# EAGLE schematic MMU8Ltqfp (EAGLE 6.6.0)

## Sheet 1 of 2
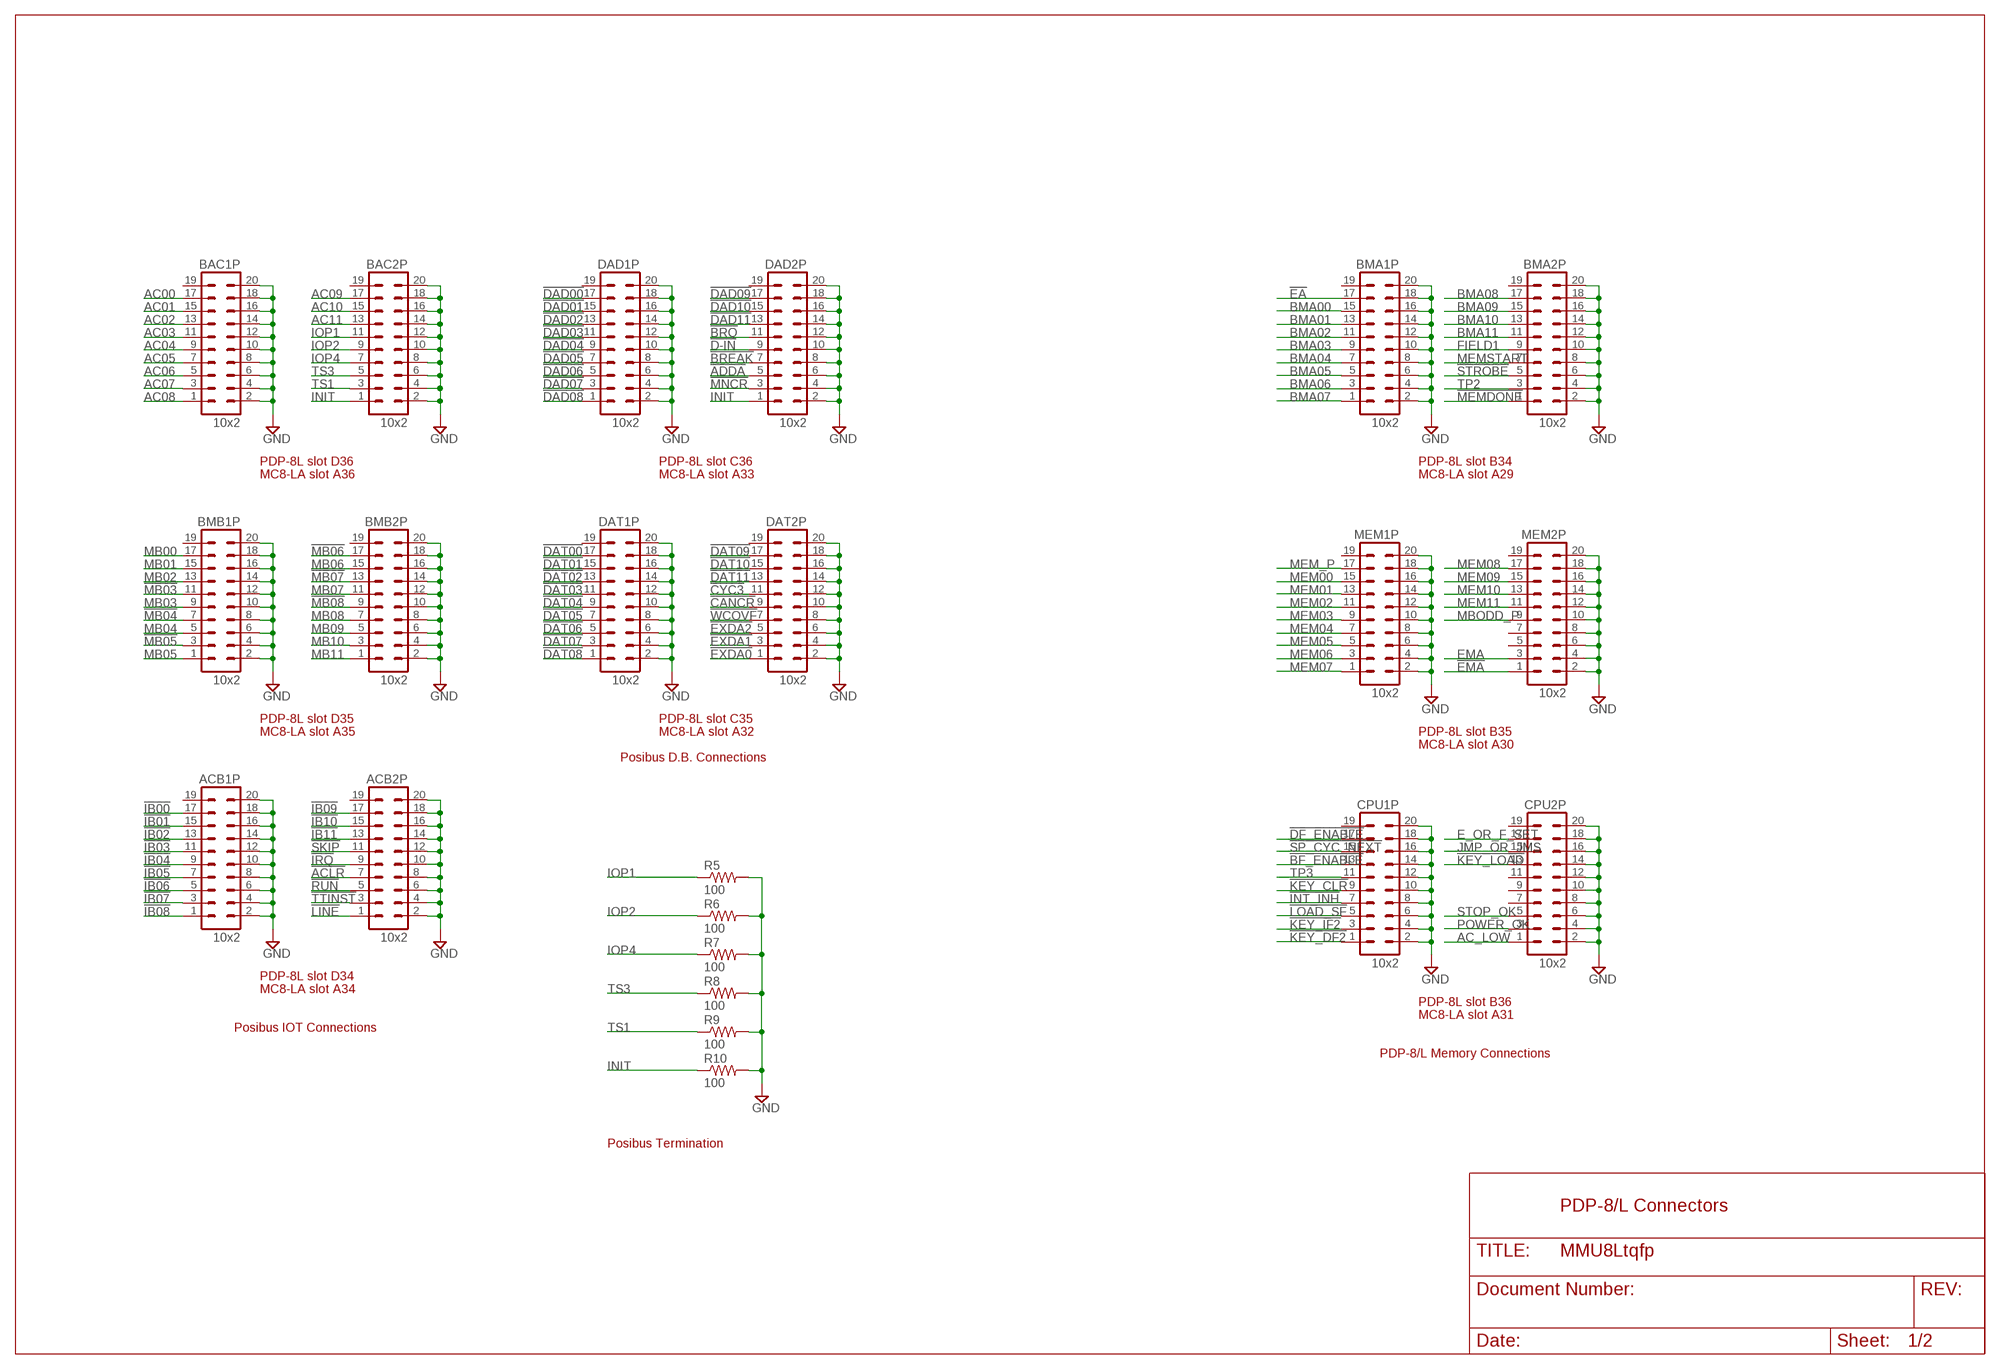
[diagram p0: schematic, sheet 1]

### Parts
ACB1P  10x2  MA10-2  [MA10-2]
ACB2P  10x2  MA10-2  [MA10-2]
BAC1P  10x2  MA10-2  [MA10-2]
BAC2P  10x2  MA10-2  [MA10-2]
BMA1P  10x2  MA10-2  [MA10-2]
BMA2P  10x2  MA10-2  [MA10-2]
BMB1P  10x2  MA10-2  [MA10-2]
BMB2P  10x2  MA10-2  [MA10-2]
CPU1P  10x2  MA10-2  [MA10-2]
CPU2P  10x2  MA10-2  [MA10-2]
DAD1P  10x2  MA10-2  [MA10-2]
DAD2P  10x2  MA10-2  [MA10-2]
DAT1P  10x2  MA10-2  [MA10-2]
DAT2P  10x2  MA10-2  [MA10-2]
MEM1P  10x2  MA10-2  [MA10-2]
MEM2P  10x2  MA10-2  [MA10-2]
R5  100  R-US_R1206  [R1206]
R6  100  R-US_R1206  [R1206]
R7  100  R-US_R1206  [R1206]
R8  100  R-US_R1206  [R1206]
R9  100  R-US_R1206  [R1206]
R10  100  R-US_R1206  [R1206]

### Nets
!ACLR: ACB2P.7 ; also sheet 2
!ADDA: DAD2P.5
!BF_ENABLE: CPU1P.13 ; also sheet 2
!BREAK: DAD2P.7
!BRQ: DAD2P.11
!CANCR: DAT2P.9
!CYC3: DAT2P.11
!D-IN: DAD2P.9
!DAD00: DAD1P.17
!DAD01: DAD1P.15
!DAD02: DAD1P.13
!DAD03: DAD1P.11
!DAD04: DAD1P.9
!DAD05: DAD1P.7
!DAD06: DAD1P.5
!DAD07: DAD1P.3
!DAD08: DAD1P.1
!DAD09: DAD2P.17
!DAD10: DAD2P.15
!DAD11: DAD2P.13
!DAT00: DAT1P.17
!DAT01: DAT1P.15
!DAT02: DAT1P.13
!DAT03: DAT1P.11
!DAT04: DAT1P.9
!DAT05: DAT1P.7
!DAT06: DAT1P.5
!DAT07: DAT1P.3
!DAT08: DAT1P.1
!DAT09: DAT2P.17
!DAT10: DAT2P.15
!DAT11: DAT2P.13
!DF_ENABLE: CPU1P.17 ; also sheet 2
!EA: BMA1P.17 ; also sheet 2
!EMA: MEM2P.1 ; also sheet 2
!EXDA0: DAT2P.1 ; also sheet 2
!EXDA1: DAT2P.3 ; also sheet 2
!EXDA2: DAT2P.5 ; also sheet 2
!IB00: ACB1P.17 ; also sheet 2
!IB01: ACB1P.15 ; also sheet 2
!IB02: ACB1P.13 ; also sheet 2
!IB03: ACB1P.11 ; also sheet 2
!IB04: ACB1P.9 ; also sheet 2
!IB05: ACB1P.7 ; also sheet 2
!IB06: ACB1P.5 ; also sheet 2
!IB07: ACB1P.3 ; also sheet 2
!IB08: ACB1P.1 ; also sheet 2
!IB09: ACB2P.17 ; also sheet 2
!IB10: ACB2P.15 ; also sheet 2
!IB11: ACB2P.13 ; also sheet 2
!INT_INH: CPU1P.7 ; also sheet 2
!IRQ: ACB2P.9 ; also sheet 2
!KEY_CLR: CPU1P.9 ; also sheet 2
!KEY_DF2: CPU1P.1 ; also sheet 2
!KEY_IF2: CPU1P.3 ; also sheet 2
!KEY_LOAD: CPU2P.13 ; also sheet 2
!LINE: ACB2P.1 ; also sheet 2
!LOAD_SF: CPU1P.5 ; also sheet 2
!MB03: BMB1P.11
!MB04: BMB1P.7
!MB05: BMB1P.3
!MB06: BMB2P.17
!MB07: BMB2P.13
!MB08: BMB2P.9
!MEMDONE: BMA2P.1 ; also sheet 2
!MNCR: DAD2P.3
!RUN: ACB2P.5 ; also sheet 2
!SKIP: ACB2P.11 ; also sheet 2
!SP_CYC_NEXT: CPU1P.15 ; also sheet 2
!STROBE: BMA2P.5 ; also sheet 2
!TTINST: ACB2P.3 ; also sheet 2
!WCOVF: DAT2P.7
AC00: BAC1P.17
AC01: BAC1P.15
AC02: BAC1P.13
AC03: BAC1P.11
AC04: BAC1P.9
AC05: BAC1P.7
AC06: BAC1P.5
AC07: BAC1P.3
AC08: BAC1P.1
AC09: BAC2P.17
AC10: BAC2P.15
AC11: BAC2P.13
AC_LOW: CPU2P.1 ; also sheet 2
BMA00: BMA1P.15 ; also sheet 2
BMA01: BMA1P.13 ; also sheet 2
BMA02: BMA1P.11 ; also sheet 2
BMA03: BMA1P.9 ; also sheet 2
BMA04: BMA1P.7 ; also sheet 2
BMA05: BMA1P.5 ; also sheet 2
BMA06: BMA1P.3 ; also sheet 2
BMA07: BMA1P.1 ; also sheet 2
BMA08: BMA2P.17 ; also sheet 2
BMA09: BMA2P.15 ; also sheet 2
BMA10: BMA2P.13 ; also sheet 2
BMA11: BMA2P.11 ; also sheet 2
E_OR_F_SET: CPU2P.17 ; also sheet 2
EMA: MEM2P.3 ; also sheet 2
FIELD1: BMA2P.9 ; also sheet 2
GND [supply]: ACB1P.2 ACB1P.4 ACB1P.6 ACB1P.8 ACB1P.10 ACB1P.12 ACB1P.14 ACB1P.16 ACB1P.18 ACB1P.20 ACB2P.2 ACB2P.4 ACB2P.6 ACB2P.8 ACB2P.10 ACB2P.12 ACB2P.14 ACB2P.16 ACB2P.18 ACB2P.20 BAC1P.2 BAC1P.4 BAC1P.6 BAC1P.8 BAC1P.10 BAC1P.12 BAC1P.14 BAC1P.16 BAC1P.18 BAC1P.20 BAC2P.2 BAC2P.4 BAC2P.6 BAC2P.8 BAC2P.10 BAC2P.12 BAC2P.14 BAC2P.16 BAC2P.18 BAC2P.20 BMA1P.2 BMA1P.4 BMA1P.6 BMA1P.8 BMA1P.10 BMA1P.12 BMA1P.14 BMA1P.16 BMA1P.18 BMA1P.20 BMA2P.2 BMA2P.4 BMA2P.6 BMA2P.8 BMA2P.10 BMA2P.12 BMA2P.14 BMA2P.16 BMA2P.18 BMA2P.20 BMB1P.2 BMB1P.4 BMB1P.6 BMB1P.8 BMB1P.10 BMB1P.12 BMB1P.14 BMB1P.16 BMB1P.18 BMB1P.20 BMB2P.2 BMB2P.4 BMB2P.6 BMB2P.8 BMB2P.10 BMB2P.12 BMB2P.14 BMB2P.16 BMB2P.18 BMB2P.20 CPU1P.2 CPU1P.4 CPU1P.6 CPU1P.8 CPU1P.10 CPU1P.12 CPU1P.14 CPU1P.16 CPU1P.18 CPU1P.20 CPU2P.2 CPU2P.4 CPU2P.6 CPU2P.8 CPU2P.10 CPU2P.12 CPU2P.14 CPU2P.16 CPU2P.18 CPU2P.20 DAD1P.2 DAD1P.4 DAD1P.6 DAD1P.8 DAD1P.10 DAD1P.12 DAD1P.14 DAD1P.16 DAD1P.18 DAD1P.20 DAD2P.2 DAD2P.4 DAD2P.6 DAD2P.8 DAD2P.10 DAD2P.12 DAD2P.14 DAD2P.16 DAD2P.18 DAD2P.20 DAT1P.2 DAT1P.4 DAT1P.6 DAT1P.8 DAT1P.10 DAT1P.12 DAT1P.14 DAT1P.16 DAT1P.18 DAT1P.20 DAT2P.2 DAT2P.4 DAT2P.6 DAT2P.8 DAT2P.10 DAT2P.12 DAT2P.14 DAT2P.16 DAT2P.18 DAT2P.20 MEM1P.2 MEM1P.4 MEM1P.6 MEM1P.8 MEM1P.10 MEM1P.12 MEM1P.14 MEM1P.16 MEM1P.18 MEM1P.20 MEM2P.2 MEM2P.4 MEM2P.6 MEM2P.8 MEM2P.10 MEM2P.12 MEM2P.14 MEM2P.16 MEM2P.18 MEM2P.20 R5.2 R6.2 R7.2 R8.2 R9.2 R10.2 ; also sheet 2
INIT: BAC2P.1 DAD2P.1 R10.1 ; also sheet 2
IOP1: BAC2P.11 R5.1 ; also sheet 2
IOP2: BAC2P.9 R6.1 ; also sheet 2
IOP4: BAC2P.7 R7.1 ; also sheet 2
JMP_OR_JMS: CPU2P.15 ; also sheet 2
MB00: BMB1P.17 ; also sheet 2
MB01: BMB1P.15 ; also sheet 2
MB02: BMB1P.13 ; also sheet 2
MB03: BMB1P.9 ; also sheet 2
MB04: BMB1P.5 ; also sheet 2
MB05: BMB1P.1 ; also sheet 2
MB06: BMB2P.15 ; also sheet 2
MB07: BMB2P.11 ; also sheet 2
MB08: BMB2P.7 ; also sheet 2
MB09: BMB2P.5 ; also sheet 2
MB10: BMB2P.3 ; also sheet 2
MB11: BMB2P.1 ; also sheet 2
MBODD_P: MEM2P.9 ; also sheet 2
MEM00: MEM1P.15 ; also sheet 2
MEM01: MEM1P.13 ; also sheet 2
MEM02: MEM1P.11 ; also sheet 2
MEM03: MEM1P.9 ; also sheet 2
MEM04: MEM1P.7 ; also sheet 2
MEM05: MEM1P.5 ; also sheet 2
MEM06: MEM1P.3 ; also sheet 2
MEM07: MEM1P.1 ; also sheet 2
MEM08: MEM2P.17 ; also sheet 2
MEM09: MEM2P.15 ; also sheet 2
MEM10: MEM2P.13 ; also sheet 2
MEM11: MEM2P.11 ; also sheet 2
MEM_P: MEM1P.17 ; also sheet 2
MEMSTART: BMA2P.7 ; also sheet 2
POWER_OK: CPU2P.3 ; also sheet 2
STOP_OK: CPU2P.5 ; also sheet 2
TP2: BMA2P.3 ; also sheet 2
TP3: CPU1P.11 ; also sheet 2
TS1: BAC2P.3 R9.1
TS3: BAC2P.5 R8.1
Unconnected: ACB1P.19 ACB2P.19 BAC1P.19 BAC2P.19 BMA1P.19 BMA2P.19 BMB1P.19 BMB2P.19 CPU1P.19 CPU2P.7 CPU2P.9 CPU2P.11 CPU2P.19 DAD1P.19 DAD2P.19 DAT1P.19 DAT2P.19 MEM1P.19 MEM2P.5 MEM2P.7 MEM2P.19

### Notes on the sheet
- PDP-8L slot D36 | PDP-8L slot C36 | PDP-8L slot B34
- MC8-LA slot A36 | MC8-LA slot A33 | MC8-LA slot A29
- PDP-8L slot D35 | PDP-8L slot C35
- MC8-LA slot A35 | MC8-LA slot A32 | PDP-8L slot B35
- MC8-LA slot A30
- Posibus D.B. Connections
- PDP-8L slot D34
- MC8-LA slot A34
- PDP-8L slot B36
- MC8-LA slot A31
- Posibus IOT Connections
- PDP-8/L Memory Connections
- Posibus Termination
- PDP-8/L Connectors

## Sheet 2 of 2
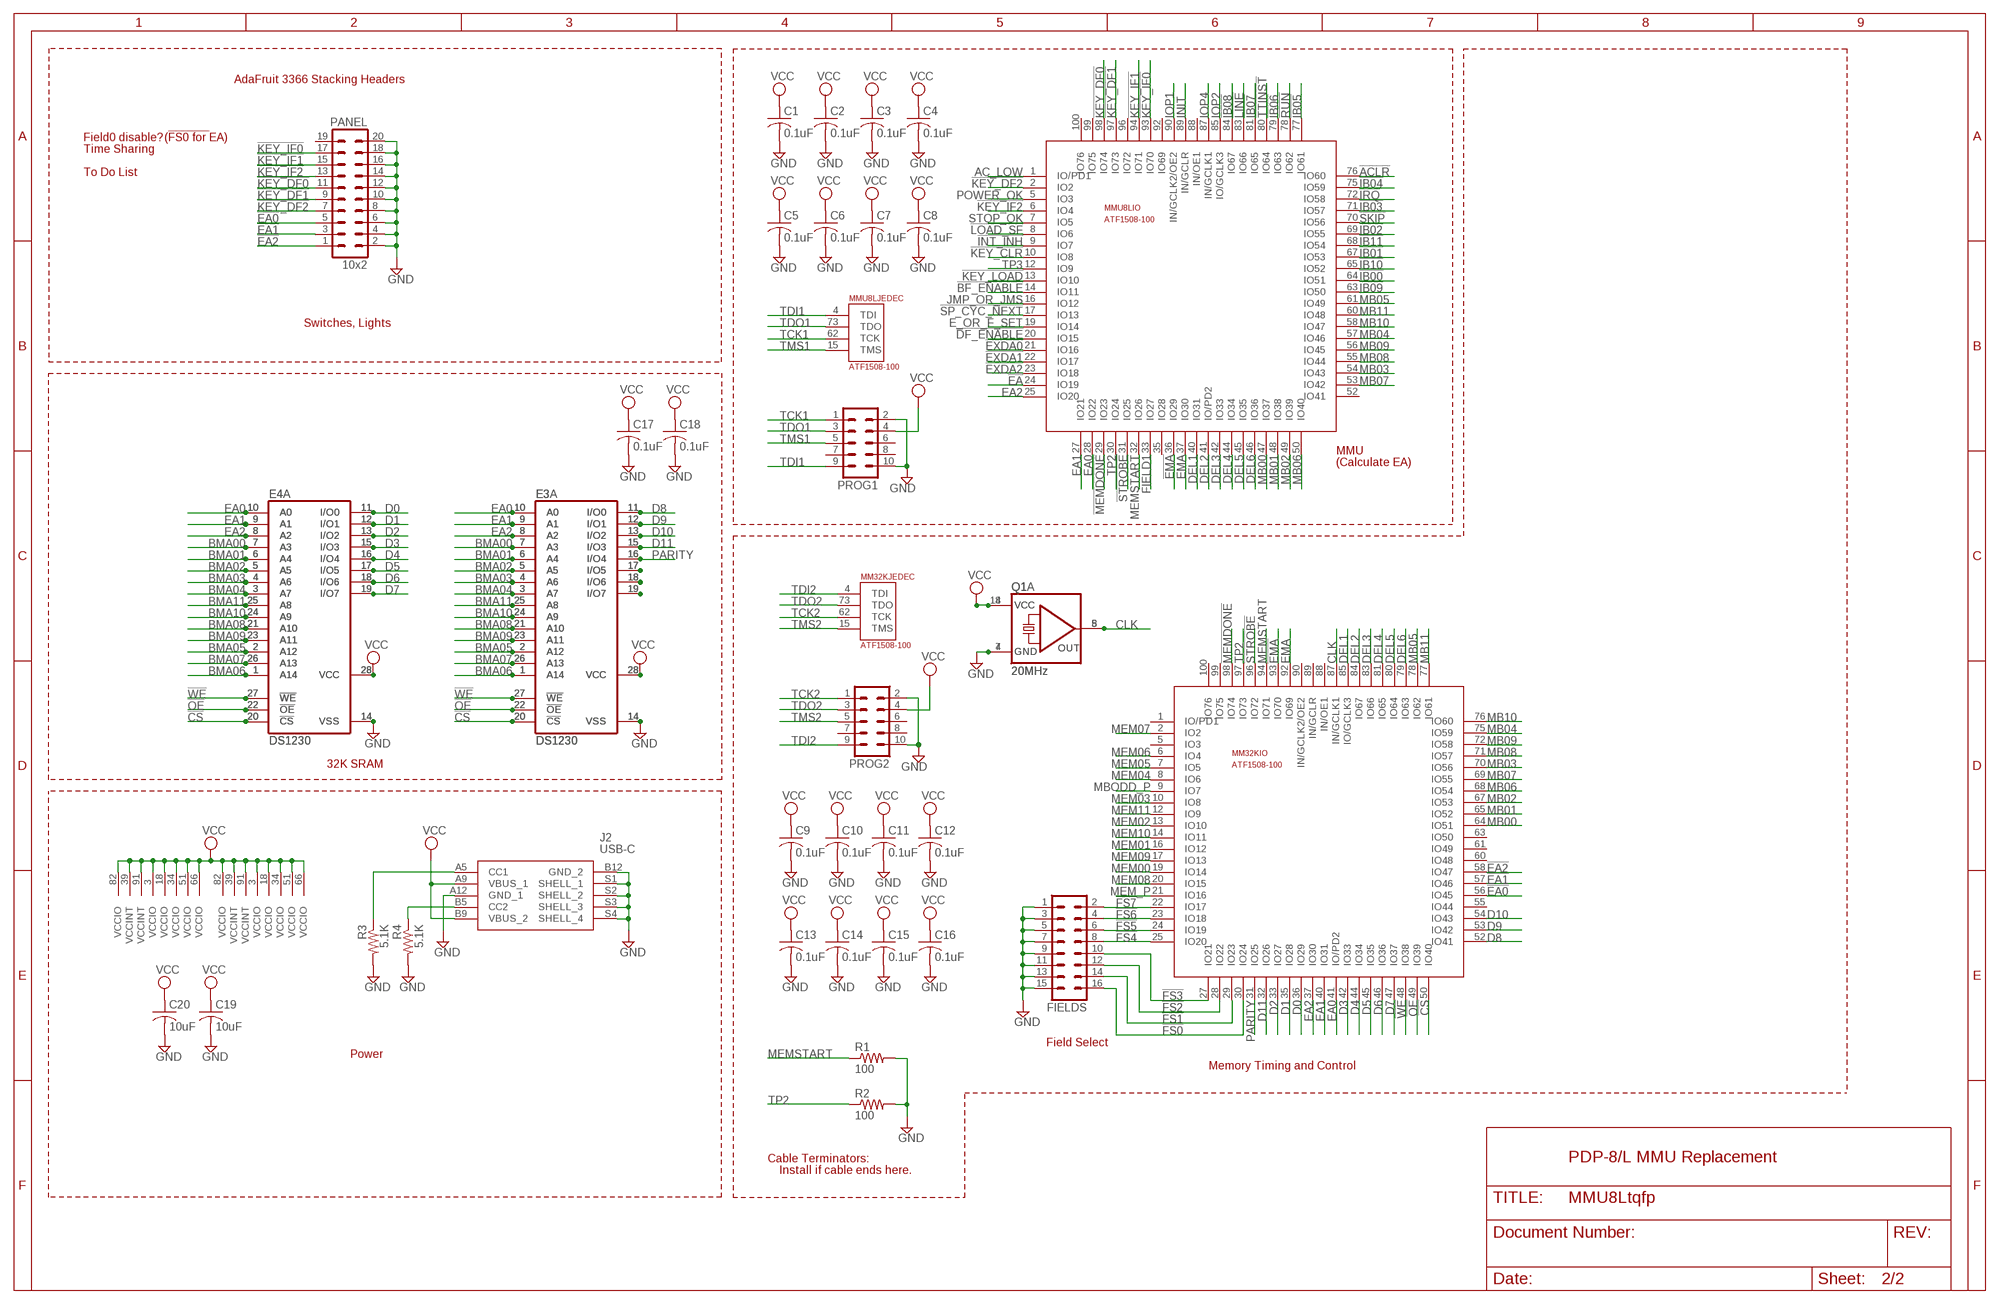
[diagram p1: schematic, sheet 2]

### Parts
C1  0.1uF  C-USC0805  [C0805]
C2  0.1uF  C-USC0805  [C0805]
C3  0.1uF  C-USC0805  [C0805]
C4  0.1uF  C-USC0805  [C0805]
C5  0.1uF  C-USC0805  [C0805]
C6  0.1uF  C-USC0805  [C0805]
C7  0.1uF  C-USC0805  [C0805]
C8  0.1uF  C-USC0805  [C0805]
C9  0.1uF  C-USC0805  [C0805]
C10  0.1uF  C-USC0805  [C0805]
C11  0.1uF  C-USC0805  [C0805]
C12  0.1uF  C-USC0805  [C0805]
C13  0.1uF  C-USC0805  [C0805]
C14  0.1uF  C-USC0805  [C0805]
C15  0.1uF  C-USC0805  [C0805]
C16  0.1uF  C-USC0805  [C0805]
C17  0.1uF  C-USC0805  [C0805]
C18  0.1uF  C-USC0805  [C0805]
C19  10uF  C-USC0805  [C0805]
C20  10uF  C-USC0805  [C0805]
E3  DS1230  62256P  [DIL28-6]
E3A  DS1230  62832P  [DIL28-3]
E4  DS1230  62256P  [DIL28-6]
E4A  DS1230  62832P  [DIL28-3]
FIELDS  MA08-2  [MA08-2]
J2  USB-C  USB4970-00-A  [USB497000A]
MM32K  ATF1508-100  ATF150X100TQFP  [TQFP-100]
MMU8L  ATF1508-100  ATF150X100TQFP  [TQFP-100]
PANEL  10x2  MA10-2  [MA10-2]
PROG1  ML10  [ML10]
PROG2  ML10  [ML10]
Q1  20MHz  QG5860  [DIL14S]
Q1A  20MHz  QG5460  [DIL08S]
R1  100  R-US_R1206  [R1206]
R2  100  R-US_R1206  [R1206]
R3  5.1K  R-US_R0805  [R0805]
R4  5.1K  R-US_R0805  [R0805]

### Nets
!ACLR: MMU8L.76(IO:IO60) ; also sheet 1
!BF_ENABLE: MMU8L.14(IO:IO11) ; also sheet 1
!CS: E3.20(!CS) E3A.20(!CS) E4.20(!CS) E4A.20(!CS) MM32K.50(IO:IO40)
!DF_ENABLE: MMU8L.20(IO:IO15) ; also sheet 1
!EA: MMU8L.24(IO:IO19) ; also sheet 1
!EA0: MM32K.56(IO:IO45) PANEL.5
!EA1: MM32K.57(IO:IO46) PANEL.3
!EA2: MM32K.58(IO:IO47) PANEL.1
!EMA: MM32K.93(IO:IO70) MMU8L.36(IO:IO29) ; also sheet 1
!EXDA0: MMU8L.21(IO:IO16) ; also sheet 1
!EXDA1: MMU8L.22(IO:IO17) ; also sheet 1
!EXDA2: MMU8L.23(IO:IO18) ; also sheet 1
!FS0: FIELDS.16 MM32K.30(IO:IO24)
!FS1: FIELDS.14 MM32K.29(IO:IO23)
!FS2: FIELDS.12 MM32K.28(IO:IO22)
!FS3: FIELDS.10 MM32K.27(IO:IO21)
!FS4: FIELDS.8 MM32K.25(IO:IO20)
!FS5: FIELDS.6 MM32K.24(IO:IO19)
!FS6: FIELDS.4 MM32K.23(IO:IO18)
!FS7: FIELDS.2 MM32K.22(IO:IO17)
!IB00: MMU8L.64(IO:IO51) ; also sheet 1
!IB01: MMU8L.67(IO:IO53) ; also sheet 1
!IB02: MMU8L.69(IO:IO55) ; also sheet 1
!IB03: MMU8L.71(IO:IO57) ; also sheet 1
!IB04: MMU8L.75(IO:IO59) ; also sheet 1
!IB05: MMU8L.77(IO:IO61) ; also sheet 1
!IB06: MMU8L.79(IO:IO63) ; also sheet 1
!IB07: MMU8L.81(IO:IO65) ; also sheet 1
!IB08: MMU8L.84(IO:IO67) ; also sheet 1
!IB09: MMU8L.63(IO:IO50) ; also sheet 1
!IB10: MMU8L.65(IO:IO52) ; also sheet 1
!IB11: MMU8L.68(IO:IO54) ; also sheet 1
!INT_INH: MMU8L.9(IO:IO7) ; also sheet 1
!IRQ: MMU8L.72(IO:IO58) ; also sheet 1
!KEY_CLR: MMU8L.10(IO:IO8) ; also sheet 1
!KEY_DF0: MMU8L.98(IO:IO74) PANEL.11
!KEY_DF1: MMU8L.97(IO:IO73) PANEL.9
!KEY_DF2: MMU8L.2(IO:IO2) PANEL.7 ; also sheet 1
!KEY_IF0: MMU8L.93(IO:IO70) PANEL.17
!KEY_IF1: MMU8L.94(IO:IO71) PANEL.15
!KEY_IF2: MMU8L.6(IO:IO4) PANEL.13 ; also sheet 1
!KEY_LOAD: MMU8L.13(IO:IO10) ; also sheet 1
!LINE: MMU8L.83(IO:IO66) ; also sheet 1
!LOAD_SF: MMU8L.8(IO:IO6) ; also sheet 1
!MEMDONE: MM32K.98(IO:IO74) MMU8L.29(IO:IO23) ; also sheet 1
!OE: E3.22(!OE) E3A.22(!OE) E4.22(!OE) E4A.22(!OE) MM32K.49(IO:IO39)
!RUN: MMU8L.78(IO:IO62) ; also sheet 1
!SKIP: MMU8L.70(IO:IO56) ; also sheet 1
!SP_CYC_NEXT: MMU8L.17(IO:IO13) ; also sheet 1
!STROBE: MM32K.96(IO:IO72) MMU8L.31(IO:IO25) ; also sheet 1
!TTINST: MMU8L.80(IO:IO64) ; also sheet 1
!WE: E3.27(!WE) E3A.27(!WE) E4.27(!WE) E4A.27(!WE) MM32K.48(IO:IO38)
AC_LOW: MMU8L.1(IO:IO/PD1) ; also sheet 1
BMA00: E3.7(A3) E3A.7(A3) E4.7(A3) E4A.7(A3) ; also sheet 1
BMA01: E3.6(A4) E3A.6(A4) E4.6(A4) E4A.6(A4) ; also sheet 1
BMA02: E3.5(A5) E3A.5(A5) E4.5(A5) E4A.5(A5) ; also sheet 1
BMA03: E3.4(A6) E3A.4(A6) E4.4(A6) E4A.4(A6) ; also sheet 1
BMA04: E3.3(A7) E3A.3(A7) E4.3(A7) E4A.3(A7) ; also sheet 1
BMA05: E3.2(A12) E3A.2(A12) E4.2(A12) E4A.2(A12) ; also sheet 1
BMA06: E3.1(A14) E3A.1(A14) E4.1(A14) E4A.1(A14) ; also sheet 1
BMA07: E3.26(A13) E3A.26(A13) E4.26(A13) E4A.26(A13) ; also sheet 1
BMA08: E3.21(A10) E3A.21(A10) E4.21(A10) E4A.21(A10) ; also sheet 1
BMA09: E3.23(A11) E3A.23(A11) E4.23(A11) E4A.23(A11) ; also sheet 1
BMA10: E3.24(A9) E3A.24(A9) E4.24(A9) E4A.24(A9) ; also sheet 1
BMA11: E3.25(A8) E3A.25(A8) E4.25(A8) E4A.25(A8) ; also sheet 1
CLK: MM32K.87(IO:IN/GCLK1) Q1.8(OUT) Q1A.5(OUT)
D0: E4.11(I/O0) E4A.11(I/O0) MM32K.36(IO:IO29)
D1: E4.12(I/O1) E4A.12(I/O1) MM32K.35(IO:IO28)
D2: E4.13(I/O2) E4A.13(I/O2) MM32K.33(IO:IO27)
D3: E4.15(I/O3) E4A.15(I/O3) MM32K.42(IO:IO33)
D4: E4.16(I/O4) E4A.16(I/O4) MM32K.44(IO:IO34)
D5: E4.17(I/O5) E4A.17(I/O5) MM32K.45(IO:IO35)
D6: E4.18(I/O6) E4A.18(I/O6) MM32K.46(IO:IO36)
D7: E4.19(I/O7) E4A.19(I/O7) MM32K.47(IO:IO37)
D8: E3.11(I/O0) E3A.11(I/O0) MM32K.52(IO:IO41)
D9: E3.12(I/O1) E3A.12(I/O1) MM32K.53(IO:IO42)
D10: E3.13(I/O2) E3A.13(I/O2) MM32K.54(IO:IO43)
D11: E3.15(I/O3) E3A.15(I/O3) MM32K.32(IO:IO26)
DEL1: MM32K.85(IO:IO/GCLK3) MMU8L.40(IO:IO31)
DEL2: MM32K.84(IO:IO67) MMU8L.41(IO:IO/PD2)
DEL3: MM32K.83(IO:IO66) MMU8L.42(IO:IO33)
DEL4: MM32K.81(IO:IO65) MMU8L.44(IO:IO34)
DEL5: MM32K.80(IO:IO64) MMU8L.45(IO:IO35)
DEL6: MM32K.79(IO:IO63) MMU8L.46(IO:IO36)
E_OR_F_SET: MMU8L.19(IO:IO14) ; also sheet 1
EA0: E3.10(A0) E3A.10(A0) E4.10(A0) E4A.10(A0) MM32K.41(IO:IO/PD2) MMU8L.28(IO:IO22)
EA1: E3.9(A1) E3A.9(A1) E4.9(A1) E4A.9(A1) MM32K.40(IO:IO31) MMU8L.27(IO:IO21)
EA2: E3.8(A2) E3A.8(A2) E4.8(A2) E4A.8(A2) MM32K.37(IO:IO30) MMU8L.25(IO:IO20)
EMA: MM32K.92(IO:IO69) MMU8L.37(IO:IO30) ; also sheet 1
FIELD1: MMU8L.33(IO:IO27) ; also sheet 1
GND [supply]: C1.2 C2.2 C3.2 C4.2 C5.2 C6.2 C7.2 C8.2 C9.2 C10.2 C11.2 C12.2 C13.2 C14.2 C15.2 C16.2 C17.2 C18.2 C19.2 C20.2 E3.14(VSS) E3A.14(VSS) E4.14(VSS) E4A.14(VSS) FIELDS.1 FIELDS.3 FIELDS.5 FIELDS.7 FIELDS.9 FIELDS.11 FIELDS.13 FIELDS.15 J2.A12(GND_1) J2.B12(GND_2) J2.S1(SHELL_1) J2.S2(SHELL_2) J2.S3(SHELL_3) J2.S4(SHELL_4) PANEL.2 PANEL.4 PANEL.6 PANEL.8 PANEL.10 PANEL.12 PANEL.14 PANEL.16 PANEL.18 PANEL.20 PROG1.2 PROG1.10 PROG2.2 PROG2.10 Q1.7(GND) Q1A.4(GND) R1.2 R2.2 R3.2 R4.2 ; also sheet 1
INIT: MMU8L.89(IO:IN/GCLR) ; also sheet 1
IOP1: MMU8L.90(IO:IN/GCLK2/OE2) ; also sheet 1
IOP2: MMU8L.85(IO:IO/GCLK3) ; also sheet 1
IOP4: MMU8L.87(IO:IN/GCLK1) ; also sheet 1
JMP_OR_JMS: MMU8L.16(IO:IO12) ; also sheet 1
MB00: MM32K.64(IO:IO51) MMU8L.47(IO:IO37) ; also sheet 1
MB01: MM32K.65(IO:IO52) MMU8L.48(IO:IO38) ; also sheet 1
MB02: MM32K.67(IO:IO53) MMU8L.49(IO:IO39) ; also sheet 1
MB03: MM32K.70(IO:IO56) MMU8L.54(IO:IO43) ; also sheet 1
MB04: MM32K.75(IO:IO59) MMU8L.57(IO:IO46) ; also sheet 1
MB05: MM32K.78(IO:IO62) MMU8L.61(IO:IO49) ; also sheet 1
MB06: MM32K.68(IO:IO54) MMU8L.50(IO:IO40) ; also sheet 1
MB07: MM32K.69(IO:IO55) MMU8L.53(IO:IO42) ; also sheet 1
MB08: MM32K.71(IO:IO57) MMU8L.55(IO:IO44) ; also sheet 1
MB09: MM32K.72(IO:IO58) MMU8L.56(IO:IO45) ; also sheet 1
MB10: MM32K.76(IO:IO60) MMU8L.58(IO:IO47) ; also sheet 1
MB11: MM32K.77(IO:IO61) MMU8L.60(IO:IO48) ; also sheet 1
MBODD_P: MM32K.9(IO:IO7) ; also sheet 1
MEM00: MM32K.19(IO:IO14) ; also sheet 1
MEM01: MM32K.16(IO:IO12) ; also sheet 1
MEM02: MM32K.13(IO:IO10) ; also sheet 1
MEM03: MM32K.10(IO:IO8) ; also sheet 1
MEM04: MM32K.8(IO:IO6) ; also sheet 1
MEM05: MM32K.7(IO:IO5) ; also sheet 1
MEM06: MM32K.6(IO:IO4) ; also sheet 1
MEM07: MM32K.2(IO:IO2) ; also sheet 1
MEM08: MM32K.20(IO:IO15) ; also sheet 1
MEM09: MM32K.17(IO:IO13) ; also sheet 1
MEM10: MM32K.14(IO:IO11) ; also sheet 1
MEM11: MM32K.12(IO:IO9) ; also sheet 1
MEM_P: MM32K.21(IO:IO16) ; also sheet 1
MEMSTART: MM32K.94(IO:IO71) MMU8L.32(IO:IO26) R1.1 ; also sheet 1
N$1: J2.B5(CC2) R4.1
N$2: E3.17(I/O5) E3A.17(I/O5)
N$3: E3.18(I/O6) E3A.18(I/O6)
N$4: E3.19(I/O7) E3A.19(I/O7)
N$5: J2.A5(CC1) R3.1
PARITY: E3.16(I/O4) E3A.16(I/O4) MM32K.31(IO:IO25)
POWER_OK: MMU8L.5(IO:IO3) ; also sheet 1
STOP_OK: MMU8L.7(IO:IO5) ; also sheet 1
TCK1: MMU8L.62(JEDEC:TCK) PROG1.1
TCK2: MM32K.62(JEDEC:TCK) PROG2.1
TDI1: MMU8L.4(JEDEC:TDI) PROG1.9
TDI2: MM32K.4(JEDEC:TDI) PROG2.9
TDO1: MMU8L.73(JEDEC:TDO) PROG1.3
TDO2: MM32K.73(JEDEC:TDO) PROG2.3
TMS1: MMU8L.15(JEDEC:TMS) PROG1.5
TMS2: MM32K.15(JEDEC:TMS) PROG2.5
TP2: MM32K.97(IO:IO73) MMU8L.30(IO:IO24) R2.1 ; also sheet 1
TP3: MMU8L.12(IO:IO9) ; also sheet 1
VCC [supply]: C1.1 C2.1 C3.1 C4.1 C5.1 C6.1 C7.1 C8.1 C9.1 C10.1 C11.1 C12.1 C13.1 C14.1 C15.1 C16.1 C17.1 C18.1 C19.1 C20.1 E3.28(VCC) E3A.28(VCC) E4.28(VCC) E4A.28(VCC) J2.A9(VBUS_1) J2.B9(VBUS_2) MM32K.3(VCCIO) MM32K.18(VCCIO) MM32K.34(VCCIO) MM32K.39(VCCINT) MM32K.51(VCCIO) MM32K.66(VCCIO) MM32K.82(VCCIO) MM32K.91(VCCINT) MMU8L.3(VCCIO) MMU8L.18(VCCIO) MMU8L.34(VCCIO) MMU8L.39(VCCINT) MMU8L.51(VCCIO) MMU8L.66(VCCIO) MMU8L.82(VCCIO) MMU8L.91(VCCINT) PROG1.4 PROG2.4 Q1.14(VCC) Q1A.8(VCC)
Unconnected: MM32K.1(IO:IO/PD1) MM32K.5(IO:IO3) MM32K.55(IO:IO44) MM32K.60(IO:IO48) MM32K.61(IO:IO49) MM32K.63(IO:IO50) MM32K.88(IO:IN/OE1) MM32K.89(IO:IN/GCLR) MM32K.90(IO:IN/GCLK2/OE2) MM32K.99(IO:IO75) MM32K.100(IO:IO76) MMU8L.35(IO:IO28) MMU8L.52(IO:IO41) MMU8L.88(IO:IN/OE1) MMU8L.92(IO:IO69) MMU8L.96(IO:IO72) MMU8L.99(IO:IO75) MMU8L.100(IO:IO76) PANEL.19 PROG1.6 PROG1.7 PROG1.8 PROG2.6 PROG2.7 PROG2.8

### Notes on the sheet
- AdaFruit 3366 Stacking Headers
- Field0 disable? | (!FS0 for !EA)
- Time Sharing
- To Do List
- Switches, Lights
- MMU
- (Calculate EA)
- 32K SRAM
- Field Select
- Power
- Memory Timing and Control
- Cable Terminators: | PDP-8/L MMU Replacement
- Install if cable ends here.

## Power pins joined to a net without a drawn wire
GND: MM32K.11(GND) MM32K.26(GND) MM32K.38(GND) MM32K.43(GND) MM32K.59(GND) MM32K.74(GND) MM32K.86(GND) MM32K.95(GND) MMU8L.11(GND) MMU8L.26(GND) MMU8L.38(GND) MMU8L.43(GND) MMU8L.59(GND) MMU8L.74(GND) MMU8L.86(GND) MMU8L.95(GND)

## Library data of the parts
ACB1P ACB2P BAC1P BAC2P BMA1P BMA2P BMB1P BMB2P CPU1P CPU2P DAD1P DAD2P DAT1P DAT2P MEM1P MEM2P PANEL = con-lstb:MA10-2: PIN HEADER; OC_FARNELL: unknown; OC_NEWARK: unknown
C1-C20 = rcl:C-US: CAPACITOR, American symbol
E3 E4 = memory-hitachi:62256P: MEMORY; OC_FARNELL: unknown; OC_NEWARK: unknown
E3A E4A = memory-hitachi:62832P: MEMORY; OC_FARNELL: unknown; OC_NEWARK: unknown
FIELDS = con-lstb:MA08-2: PIN HEADER; OC_FARNELL: unknown; OC_NEWARK: unknown
J2 = USB4970-00-A:USB4970-00-A: USB-C (USB TYPE-C) Receptacle Connector 24 (6+18 Dummy) Position Surface Mount, Right Angle; Through Hole Source: Datasheet <3dcadmodel>; DESCRIPTION: USB-C (USB TYPE-C) Receptacle Connector 24 (6+18 Dummy) Position Surface Mount, Right Angle; Through Hole; HEIGHT: 3.41mm; MANUFACTURER_NAME: GCT (GLOBAL CONNECTOR TECHNOLOGY); MANUFACTURER_PART_NUMBER: USB4970-00-A
MM32K MMU8L = atmel-cpld:ATF150X100: ATF150x in 100 pin package.
PROG1 PROG2 = con-harting-ml:ML10: HARTING; OC_FARNELL: unknown; OC_NEWARK: unknown
Q1 = crystal:QG5860: CRYSTAL RESONATOR; OC_FARNELL: unknown; OC_NEWARK: unknown
Q1A = crystal:QG5460: CRYSTAL RESONATOR; OC_FARNELL: unknown; OC_NEWARK: unknown
R1-R10 = rcl:R-US_: RESISTOR, American symbol

## Net classes
0 default: width 0.356 mm
1 supply: width 0.356 mm